# EAGLE design V2_alternatives Layout (EAGLE 6.4)
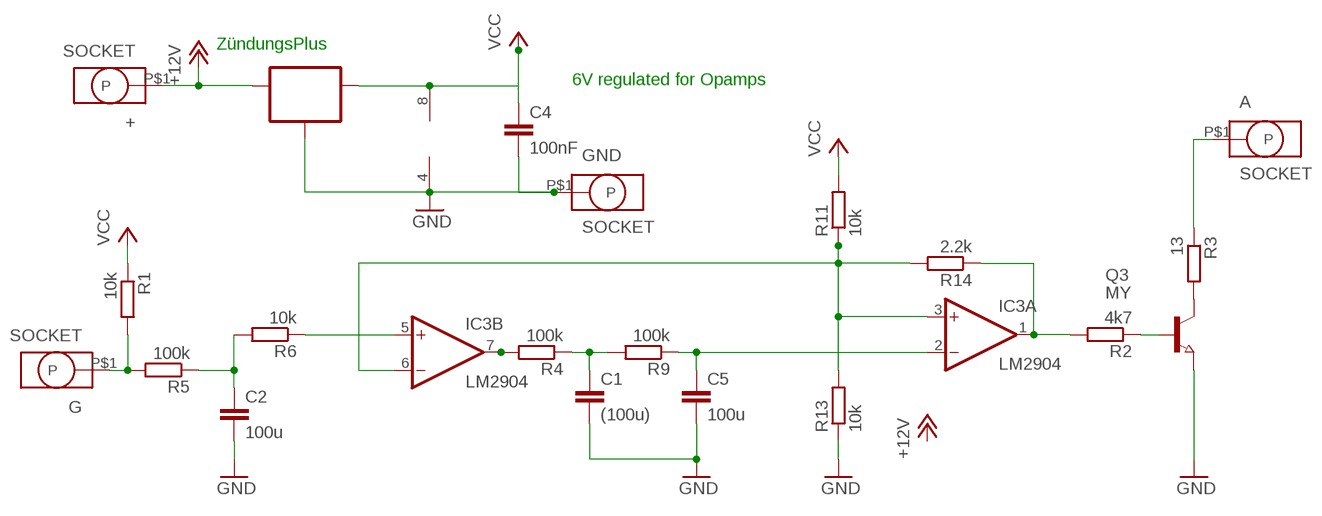
[diagram p0: schematic, sheet 1]

## Parts
+  SOCKET  [ID2.5MM]
A  SOCKET  [ID2.5MM]
C1  (100u)  C-EUC1206K  [C1206K]
C2  100u  C-EUC1206K  [C1206K]
C4  100nF  C-EUC0805  [C0805]
C5  100u  C-EUC1206K  [C1206K]
G  SOCKET  [ID2.5MM]
GND  SOCKET  [ID2.5MM]
IC2  70L06  78LXXSOT89_ROUND  [SOT89_ROUND]
IC3  LM2904  LM358D  [SO08]
Q3  MY  NPN-TRANSISTOR_SOT89  [SOT89]
R1  10k  R-EU_R0805  [R0805]
R2  4k7  R-EU_R0805  [R0805]
R3  13  R-EU_R1206  [R1206]
R4  100k  R-EU_R0805  [R0805]
R5  100k  R-EU_R0805  [R0805]
R6  10k  R-EU_R0805  [R0805]
R9  100k  R-EU_R0805  [R0805]
R11  10k  R-EU_R0805  [R0805]
R13  10k  R-EU_R0805  [R0805]
R14  2.2k  R-EU_R0805  [R0805]

## Nets
+12V: +.P$1(P) IC2.3(IN)
GND: C1.2 C2.2 C4.2 C5.2 GND.P$1(P) IC2.2(GND) IC2.2@1(GND) IC3.4(P:V-) Q3.3(E) R13.1
N$1: C2.1 R5.1 R6.2
N$2: Q3.1(B) R2.1
N$3: C1.1 R4.1 R9.2
N$4: C5.1 IC3.2(A:-IN) R9.1
N$5: IC3.3(A:+IN) IC3.6(B:-IN) R11.1 R13.2 R14.2
N$6: G.P$1(P) R1.2 R5.2
N$8: Q3.2(C) R3.2
N$9: IC3.5(B:+IN) R6.1
N$10: IC3.1(A:OUT) R2.2 R14.1
N$11: A.P$1(P) R3.1
N$580: IC3.7(B:OUT) R4.2
VCC: C4.1 IC2.1(OUT) IC3.8(P:V+) R1.1 R11.2

## Notes on the sheet
- ZündungsPlus
- 6V regulated for Opamps

## Library data of the parts
+ A G GND = Brotbox_Socket_Header:SOCKET
C1 C2 C4 C5 = rcl:C-EU: CAPACITOR, European symbol
IC2 = 78LXX:78LXX
IC3 = linear_BMW:LM358: OP AMP also LM158; LM258; LM2904 Source: http://cache.national.com/ds/LM/LM158.pdf
Q3 = Transistor_SOT89:NPN-TRANSISTOR_: NPN TRANSISTOR
R1-R6 R9 R11 R13 R14 = rcl:R-EU_: RESISTOR, European symbol

## Board
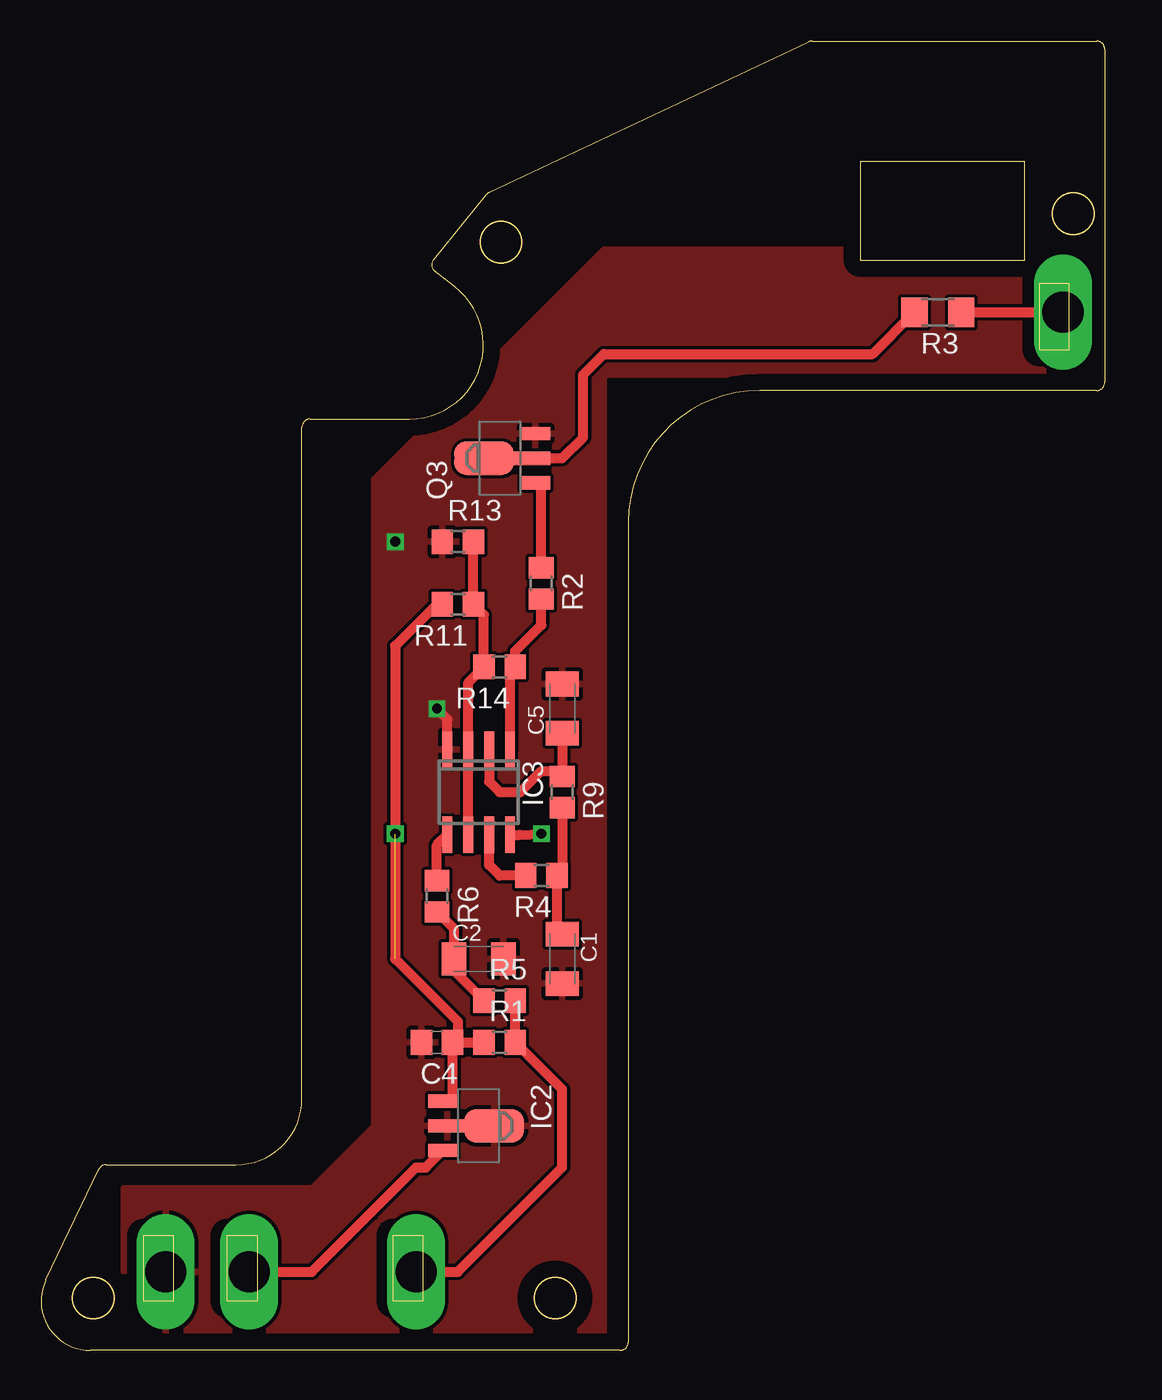
[diagram p1: board, top side]
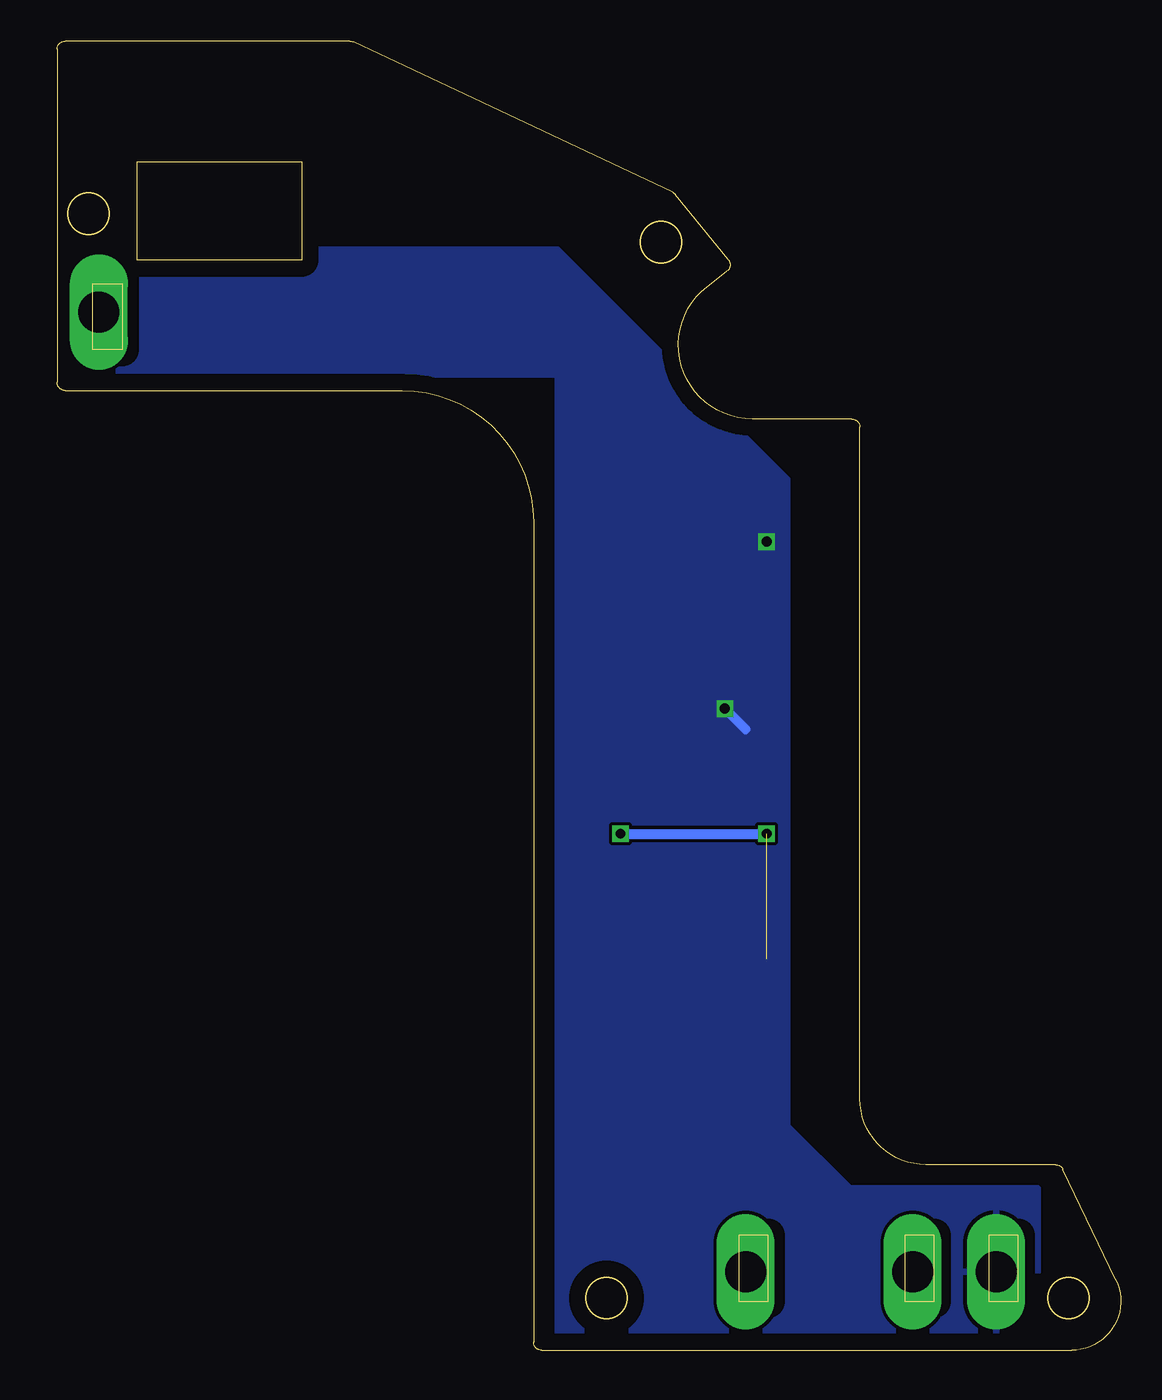
[diagram p2: board, bottom side, seen from below]

Size 64.73 x 79.71 mm. Coordinates in mm from the lower left corner, seen from the top.
Outline: 3.97,11.3 11.88,11.3 arc90 15.88,15.3 15.88,56.2 arc-90 16.38,56.7 22.42,56.7 arc142 25.18,64.75 23.97,65.7 arc-91 23.89,66.41 27.1,70.36 arc-26 27.28,70.5 46.72,79.66 arc-25 46.93,79.71 64.23,79.71 arc-90 64.73,79.21 64.73,58.93 arc-90 64.23,58.43 43.74,58.43 arc90 35.74,50.43 35.74,0.5 arc-90 35.24,0 3,0 arc-116 0.29,4.3 3.52,11.02 arc-64 3.97,11.3
Outline: 8.04,3 6.24,3 6.24,7 8.04,7 8.04,3
Outline: 13.14,7 13.14,3 11.34,3 11.34,7 13.14,7
Outline: 21.44,3 21.44,7 23.24,7 23.24,3 21.44,3
Outline: 62.56,60.93 62.56,64.93 60.76,64.93 60.76,60.93 62.56,60.93
Outline: 59.86,72.36 49.86,72.36 49.86,66.36 59.86,66.36 59.86,72.36
Outline: circle at 31.29,3.18 radius 1.25
Outline: circle at 3.17,3.18 radius 1.25
Outline: circle at 27.98,67.46 radius 1.25
Outline: circle at 62.82,69.2 radius 1.25
Copper layers (1*16): Top 0.035mm / dielectric 1.5mm / Bottom 0.035mm
Design rules "default": minimum track width 10mil, minimum drill 24mil, track to track 8mil, track to pad 8mil, pad to pad 8mil, via to via 8mil, smd to smd 8mil, copper to edge 40mil, drill to drill 8mil, minimum pad ring 10mil, minimum via ring 8mil, stop-mask expansion 4mil, vias tented up to drill 0mil, thermal gap 10mil

### Footprints (pad centres in the part's own frame; a part is rotated, then mirrored left to right if it is on the bottom)
ID2.5MM = drill 2.5 long: P$1 0,0
C1206K = smd 1.5 x 2: 1 -1.5,0; 2 1.5,0
C0805 = smd 1.3 x 1.5: 1 -0.95,0; 2 0.95,0
SOT89_ROUND = smd 0.8 x 1.8: 1 -1.499,-2.181; 3 1.499,-2.181 | smd 0.8 x 2.3: 2 0,-1.927 | smd 2.032 x 3.65: 2@1 0,0.94
SO08 = smd 0.6 x 2.2: 1 -1.905,-2.6; 2 -0.635,-2.6; 3 0.635,-2.6; 4 1.905,-2.6; 5 1.905,2.6; 6 0.635,2.6; 7 -0.635,2.6; 8 -1.905,2.6
SOT89 = smd 0.8 x 1.8: 1 -1.499,-2.181; 3 1.499,-2.181 | smd 0.8 x 2.3: 2 0,-1.927 | smd 2.032 x 3.65: 2@1 0,0.94
R0805 = smd 1.3 x 1.5: 1 -0.95,0; 2 0.95,0
R1206 = smd 1.6 x 1.803: 1 -1.422,0; 2 1.422,0

### Placement (x,y rotation side)
+  12.66,4.78 90 top
A  62.19,63.2 90 top
C1  31.71,23.83 270 top
C2  26.63,23.83 0 top
C4  24.09,18.75 180 top
C5  31.71,39.07 90 top
G  22.82,4.78 90 top
GND  7.58,4.78 90 top
IC2  26.63,13.67 270 top
IC3  26.63,33.99 180 top
Q3  27.9,54.31 90 top
R1  27.9,18.75 0 top
R2  30.44,46.69 270 top
R3  54.57,63.2 180 top
R4  30.44,28.91 180 top
R5  27.9,21.29 0 top
R6  24.09,27.64 270 top
R9  31.71,33.99 270 top
R11  25.36,45.42 180 top
R13  25.36,49.23 0 top
R14  27.9,41.61 180 top

### Tracks (layer width: path | path; a pad name or v marks a point on that pad's centre or on a via)
+12V
  Top 0.61: +.P$1 16.47,4.78 22.82,11.13 23.41,11.13 IC2.3
GND  (via drill 0.6)
  Top 0.61: IC3.4 24.73,38.43 v24.09,39.07
  Bottom 0.61: v24.09,39.07 22.82,37.8
  other vias: 21.55,49.23
  pour Bottom: 5.04,0.97 34.25,0.97 34.25,59.39 64.73,59.39 64.73,67.01 34.25,67.01 20.28,53.04 20.28,13.67 16.47,9.86 5.04,9.86
  pour Top: 5.04,0.97 34.25,0.97 34.25,59.39 64.73,59.39 64.73,67.01 34.25,67.01 20.28,53.04 20.28,13.67 16.47,9.86 5.04,9.86
N$1
  Top 0.61: R6.2 25.13,25.65 C2.1 25.13,23.11 R5.1
N$2
  Top 0.61: R2.1 30.44,52.45 Q3.1
N$3
  Top 0.61: R9.2 31.71,29.23 R4.1 31.39,25.65 C1.1
N$4
  Top 0.61: C5.1 R9.1 31.39,35.26 30.44,35.26 29.17,33.99 27.9,33.99 27.27,34.62 IC3.2
N$5
  Top 0.61: IC3.6 IC3.3 26,40.65 R14.2 26.95,44.78 R11.1 R13.2
N$6
  Top 0.61: G.P$1 25.36,4.78 31.71,11.13 31.71,15.89 R1.2 R5.2
N$8
  Top 0.61: Q3.2 31.71,54.31 32.98,55.58 32.98,59.39 34.25,60.66 50.61,60.66 R3.2
N$9
  Top 0.61: R6.1 24.09,30.75 IC3.5
N$10
  Top 0.61: IC3.1 28.54,41.29 R14.1 28.85,42.56 30.44,44.15 R2.2
N$11
  Top 0.61: R3.1 A.P$1
N$580
  Top 0.61: R4.2 27.9,28.91 27.27,29.54 IC3.7
VCC  (via drill 0.6)  (1 unrouted)
  Top 0.61: IC2.1 25.04,15.17 C4.1 | C4.1 R1.1 | R11.2 24.09,45.42 21.55,42.88 21.55,23.83 25.36,20.02 25.36,19.07 C4.1 | IC3.8 29.11,31.39 v30.44,31.45
  Bottom 0.61: v30.44,31.45 v21.55,31.45